# EAGLE design Adafruit DS2482S-800 Breakout (EAGLE 9.6.2)
COMPANY: ADAFRUIT INDUSTRIES; DRAWN: KTOWN; REV: A
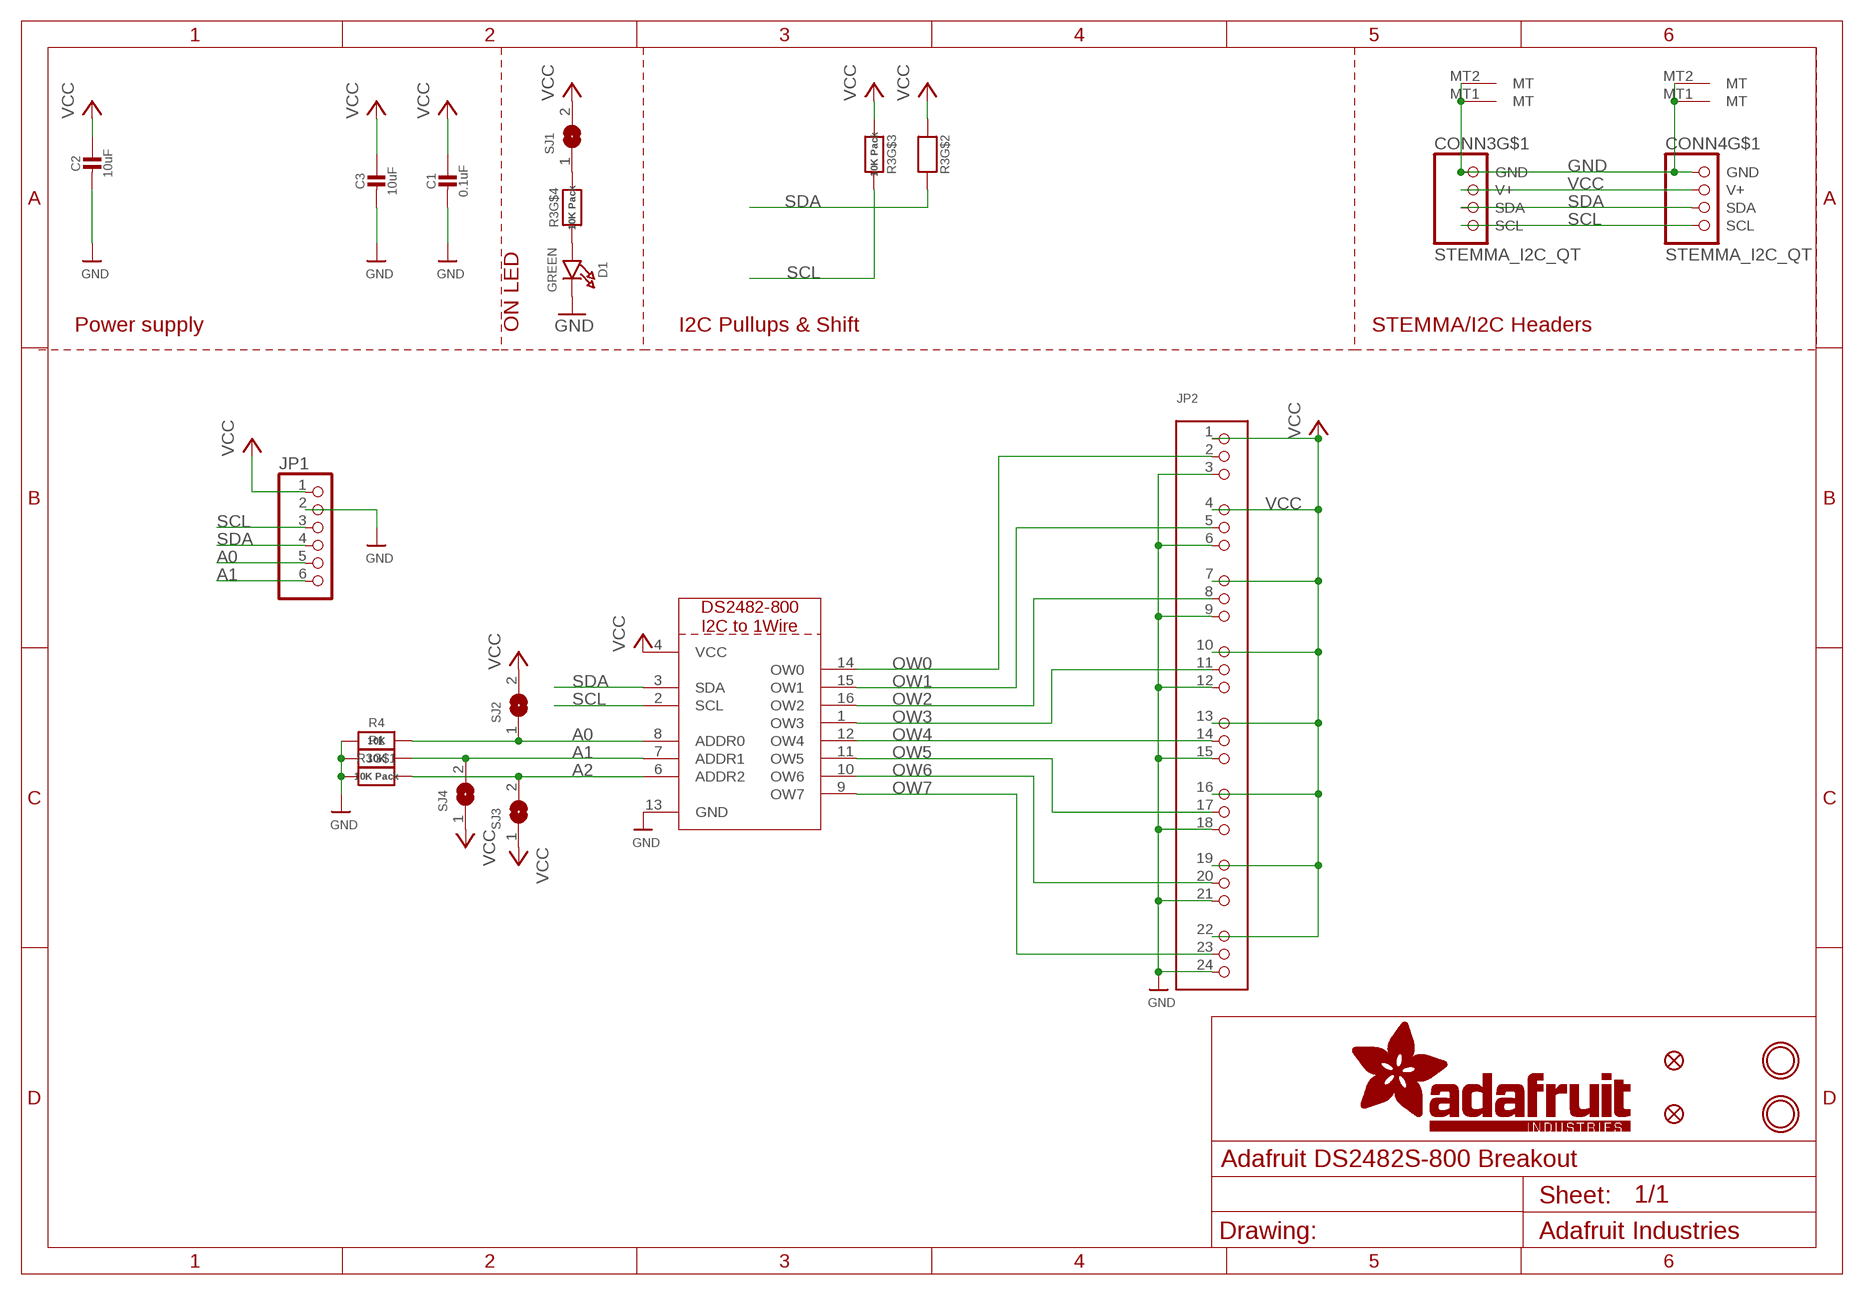
[diagram p0: schematic, sheet 1]

## Parts
C1  0.1uF  CAP_CERAMIC0603_NO  [0603-NO]
C2  10uF  CAP_CERAMIC0805-NOOUTLINE  [0805-NO]
C3  10uF  CAP_CERAMIC0805-NOOUTLINE  [0805-NO]
CONN3  STEMMA_I2C_QT  [JST_SH4]
CONN4  STEMMA_I2C_QT  [JST_SH4]
D1  GREEN  LED0603_NOOUTLINE  [CHIPLED_0603_NOOUTLINE]
FID3  FIDUCIAL_1MM  [FIDUCIAL_1MM]
FID4  FIDUCIAL_1MM  [FIDUCIAL_1MM]
JP1  HEADER-1X670MIL  [1X06_ROUND_70]
JP2  HEADER-3X08  [3X08]
R1  10K  RESISTOR_0603_NOOUT  [0603-NO]
R3  10K Pack  RESISTOR_4PACK  [RESPACK_4X0603]
R4  10K  RESISTOR_0603_NOOUT  [0603-NO]
SJ1  SOLDERJUMPERCLOSED  [SOLDERJUMPER_CLOSEDWIRE]
SJ2  SOLDERJUMPER  [SOLDERJUMPER_ARROW_NOPASTE]
SJ3  SOLDERJUMPER  [SOLDERJUMPER_ARROW_NOPASTE]
SJ4  SOLDERJUMPER  [SOLDERJUMPER_ARROW_NOPASTE]
U$19  MOUNTINGHOLE2.5  [MOUNTINGHOLE_2.5_PLATED]
U$21  MOUNTINGHOLE2.5  [MOUNTINGHOLE_2.5_PLATED]
X1  DS2482-800  [SO16]

## Nets
A0: JP1.5 R4.2 SJ2.1 X1.8(ADDR0)
A1: JP1.6 R1.2 SJ4.2 X1.7(ADDR1)
A2: R3.8 SJ3.2 X1.6(ADDR2)
GND [highpower]: C1.2 C2.2 C3.2 CONN3.1(GND) CONN3.MT1(MT) CONN3.MT2(MT) CONN4.1(GND) CONN4.MT1(MT) CONN4.MT2(MT) D1.C JP1.2 JP2.3 JP2.6 JP2.9 JP2.12 JP2.15 JP2.18 JP2.21 JP2.24 R1.1 R3.1 R4.1 X1.13(GND)
N$1: D1.A R3.4
N$2: R3.5 SJ1.1
OW0: JP2.2 X1.14(OW0)
OW1: JP2.5 X1.15(OW1)
OW2: JP2.8 X1.16(OW2)
OW3: JP2.11 X1.1(OW3)
OW4: JP2.14 X1.12(OW4)
OW5: JP2.17 X1.11(OW5)
OW6: JP2.20 X1.10(OW6)
OW7: JP2.23 X1.9(OW7)
SCL: CONN3.4(SCL) CONN4.4(SCL) JP1.3 R3.6 X1.2(SCL)
SDA: CONN3.3(SDA) CONN4.3(SDA) JP1.4 R3.7 X1.3(SDA)
VCC [highpower]: C1.1 C2.1 C3.1 CONN3.2(V+) CONN4.2(V+) JP1.1 JP2.1 JP2.4 JP2.7 JP2.10 JP2.13 JP2.16 JP2.19 JP2.22 R3.2 R3.3 SJ1.2 SJ2.2 SJ3.1 SJ4.1 X1.4(VCC)

## Notes on the sheet
- Power supply | ON LED | I2C Pullups & Shift | STEMMA/I2C Headers

## Library data of the parts
C1-C3 = microbuilder:CAP_CERAMIC: Ceramic Capacitors For new designs, use the packages preceded by an '_' character since they are more reliable: The following footprints should be used on most boards: _0402 - Standard footprint for regular board layouts _0603 - Standard footprint for regular board layouts _0805 - Standard footprint for regular board layouts _1206 - Standard footprint for regular board layouts For extremely tight-pitch boards where space is at a premium, the following 'micro-pitch' footprints can be used (smaller pads, no silkscreen outline, etc.): _0402MP - Micro-pitch footprint for very dense/compact boards _0603MP - Micro-pitch footprint for very dense/compact boards _0805MP - Micro-pitch footprint for very dense/compact boards _1206MP - Micro-pitch footprint for very dense/compact boards
CONN3 CONN4 = adafruit_electromech:STEMMA_I2C; LCSC: C2845363
D1 = microbuilder:LED: LED 0603 - 0603 Surface Mount Package 2mA: Green LED - Low Power (3.9mcd, 2ma, 1.7Vf) - Digikey: 475-2709-2-ND Orange LED - Low Power (9.8mcd, 2ma, 1.8Vf) - Digikey: 475-1194-2-ND Red LED - Low Power (5mcd, 2ma, 1.8Vf) - Digikey: 475-1195-2-ND Yellow LED - Low Power (7mcd, 2ma, 1.8Vf) - Digikey: 475-1196-2-ND 5mA: Blue LED - Low Power (17mcd, 5ma, 2.9Vf) - Digikey: LNJ937W8CRACT-ND 0805 - 0805 Surface Mount Package 2mA: Red LED (8.8mcd, 2mA, 1.8Vf, Clear) - Low Power [Digikey: 475-2510-1-ND] Green LED (5mcd, 2mA, 1.8Vf, Clear) - Low Power [Digikey: 475-2730-1-ND] Yellow LED (11.3mcd, 2mA, 1.8Vf, Clear) - Low Power [Digikey: 475-2555-1-ND] 20mA: Red LED (104mcd, 20mA, Diffused) - LS R976 [Digikey: 475-1278-6-ND] Red LED (12mcd, 20mA, 2.0Vf, Clear) - APT2012EC [Digikey: 754-1128-1-ND] Green LED (15mcd, 20mA, 2.2Vf, Clear) - APT2012GC [Digikey: 754-1131-1-ND] Orange LED (160mcd, 20mA, 2.1Vf, Clear) - APT2012SECK [Digikey: 754-1130-1-ND] 1206 - 1206 Surface Mount Package Green LED (26mcd, 20mA, Diffused) - LG N971 [Digikey: 475-1407-6-ND] Red LED (15mcd, 20mA, Diffused) - LH N974 [Digikey: 475-1416-6-ND] Cree - Cree High-Power Surface Mount LEDs XPEBWT-L1-0000-00D50 - White 111lm 350mA 2.9Vf 6200K 110° XTEAWT-00-0000-00000LEE3 - White 114lm 350mA 2.85Vf 5000K 115° Everlight - Everlight 45-21 Series Surface Mount LEDs 45-21/QK2C-B2832AC2CB2/2T - Warm White 2000mcd 20mA 3.25Vf 3050K 120° 45-21/LK2C-B38452C4CB2/2T - Nuetral White 2000mcd 20mA 3.25Vf 4150K 120° 45-21/LK2C-B50634C6CB2/2T - Cold White 2200mcd 20mA 3.25Vf 5650K 120° PLCC2 Reverse Mount LS T77K-J1L2-1-0-2-R18-Z - Red 11.25mcd 2mA 1.8Vf 630nm 120° LO T77K-L1M2-24-Z - Orange 19.6mcd 2mA 1.8Vf 606nm 120° LY T77K-K2M1-26-Z - Yellow 15.7mcd 2mA 1.8Vf 587nm 120°; ROT: 270
FID3 FID4 = microbuilder:FIDUCIAL: Fiducial Alignment Points Various fiducial points for machine vision alignment.; BOM: EXCLUDE
JP1 = microbuilder:HEADER-1X6: PIN HEADER
JP2 = microbuilder:HEADER-3X08: 3x8 0.1" Headers Male - 4UCON: 01058
R1 R4 = microbuilder:RESISTOR: Resistors For new designs, use the packages preceded by an '_' character since they are more reliable: The following footprints should be used on most boards: _0402 - Standard footprint for regular board layouts _0603 - Standard footprint for regular board layouts _0805 - Standard footprint for regular board layouts _1206 - Standard footprint for regular board layouts For extremely tight-pitch boards where space is at a premium, the following 'micro-pitch' footprints can be used (smaller pads, no silkscreen outline, etc.): _0402MP - Micro-pitch footprint for very dense/compact boards _0603MP - Micro-pitch footprint for very dense/compact boards _0805MP - Micro-pitch footprint for very dense/compact boards _1206MP - Micro-pitch footprint for very dense/compact boards
R3 = microbuilder:RESISTOR_4PACK: Resistor Packs (4 resistors) 4 x 0603 10K 1/16W - Digikey: YC164J-10KCT-ND
SJ1 = microbuilder:SOLDERJUMPER: SMD Solder JUMPER Solder the two pads together to create a connection, or remove the solder to break it. REFLOW - Use this footprint for solder paste and reflow ovens. WAVE - Use this footprint for hand-soldering (larger pads). CLOSED - Has a trace between the two pads to ensure it is closed by default. The trace needs to be cut to disable the jumper, and can be closed again by creating a solder bridge between the two pads.
SJ2-SJ4 = microbuilder:SOLDERJUMPER: SMD Solder JUMPER Solder the two pads together to create a connection, or remove the solder to break it. REFLOW - Use this footprint for solder paste and reflow ovens. WAVE - Use this footprint for hand-soldering (larger pads). CLOSED - Has a trace between the two pads to ensure it is closed by default. The trace needs to be cut to disable the jumper, and can be closed again by creating a solder bridge between the two pads.; BOM: EXCLUDE
U$19 U$21 = adafruit_electromech:MOUNTINGHOLE: Mounting Hole For #2 screws (0.086"/2.18mm width, 0.094"/2.4mm hole) use 2.5mm; BOM: EXCLUDE
X1 = adafruit_sensor:DS2482-800

## Net classes
1 highpower: width 0.305 mm, drill 0.483 mm
2 lowpower: width 0.254 mm, drill 0.483 mm

## Board
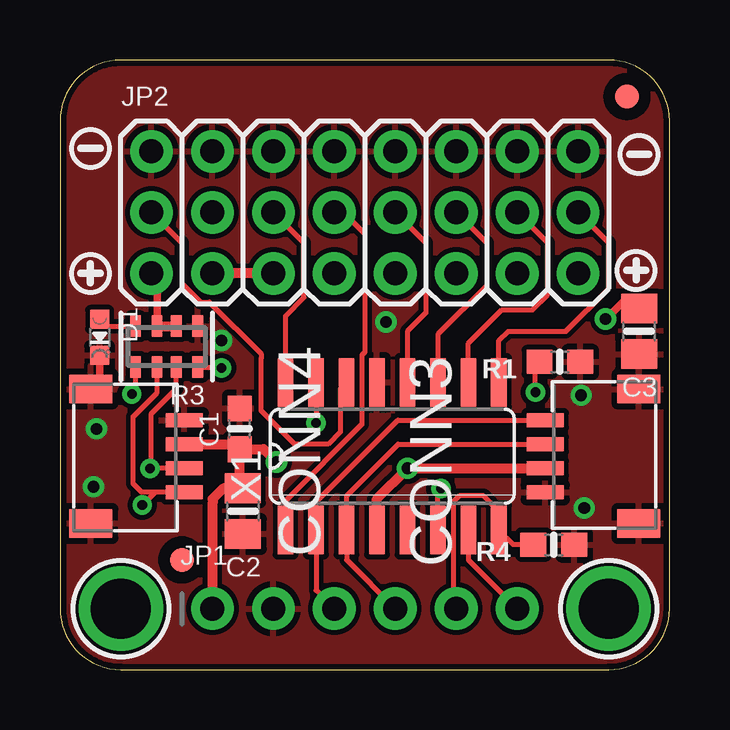
[diagram p1: board, top side]
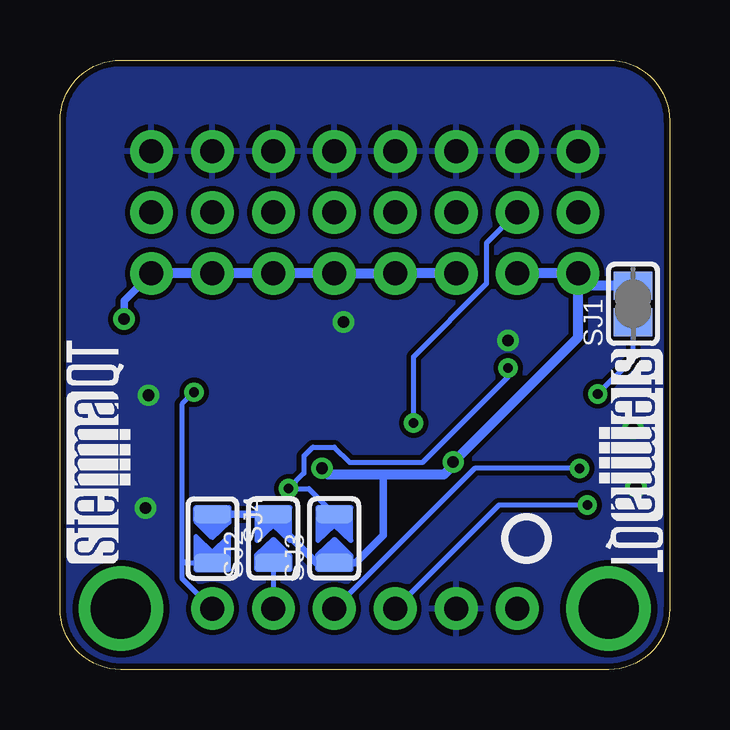
[diagram p2: board, bottom side, seen from below]

Size 25.4 x 25.4 mm. Coordinates in mm from the lower left corner, seen from the top.
Outline: 0,22.86 0,2.54 arc90 2.54,0 22.86,0 arc90 25.4,2.54 25.4,22.86 arc90 22.86,25.4 2.54,25.4 arc90 0,22.86
Copper layers (1*16): Top 0.035mm / dielectric 1.5mm / Bottom 0.035mm
Design rules "adafruit *": minimum track width 8mil, minimum drill 15.5mil, track to track 8mil, track to pad 8mil, pad to pad 8mil, via to via 8mil, smd to smd 8mil, copper to edge 10mil, drill to drill 8mil, minimum pad ring 10mil, minimum via ring 8mil, stop-mask expansion 2mil, vias tented up to drill 20mil, thermal gap 10mil

### Footprints (pad centres in the part's own frame; a part is rotated, then mirrored left to right if it is on the bottom)
0603-NO = smd 1.075 x 1: 1 -0.85,0; 2 0.85,0
0805-NO = smd 1.24 x 1.5: 1 -0.95,0; 2 0.95,0
JST_SH4 = smd 0.6 x 1.55: 1 -1.5,2.006; 2 -0.5,2.006; 3 0.5,2.006; 4 1.5,2.006 | smd 1.2 x 1.8: MT1 -2.8,-1.894; MT2 2.8,-1.894
CHIPLED_0603_NOOUTLINE = smd 0.8 x 0.8: A 0,-0.75; C 0,0.75
FIDUCIAL_1MM = smd 1 x 1: 1 0,0
1X06_ROUND_70 = drill 1 pad 1.778: 1 -6.35,0; 2 -3.81,0; 3 -1.27,0; 4 1.27,0; 5 3.81,0; 6 6.35,0
3X08 = drill 1 pad 1.778: 1 -8.89,-2.54; 2 -8.89,0; 3 -8.89,2.54; 4 -6.35,-2.54; 5 -6.35,0; 6 -6.35,2.54; 7 -3.81,-2.54; 8 -3.81,0; 9 -3.81,2.54; 10 -1.27,-2.54; 11 -1.27,0; 12 -1.27,2.54; 13 1.27,-2.54; 14 1.27,0; 15 1.27,2.54; 16 3.81,-2.54; 17 3.81,0; 18 3.81,2.54; 19 6.35,-2.54; 20 6.35,0; 21 6.35,2.54; 22 8.89,-2.54; 23 8.89,0; 24 8.89,2.54
RESPACK_4X0603 = smd 0.45 x 0.9: 1 -1.3,-0.85; 2 -0.4,-0.85; 3 0.4,-0.85; 4 1.3,-0.85; 5 1.3,0.85; 6 0.4,0.85; 7 -0.4,0.85; 8 -1.3,0.85
SOLDERJUMPER_CLOSEDWIRE = smd 1.168 x 1.6: 1 -0.762,0; 2 0.762,0 | smd 0.635 x 0.203: WIRE 0,0
SOLDERJUMPER_ARROW_NOPASTE = smd 0.762 x 1.524: 1 -1.016,0; 2 1.016,0
MOUNTINGHOLE_2.5_PLATED = drill 2.5 pad 3.2: P$1 0,0
SO16 = smd 0.66 x 2.032: 1 -4.445,-3.073; 2 -3.175,-3.073; 3 -1.905,-3.073; 4 -0.635,-3.073; 5 0.635,-3.073; 6 1.905,-3.073; 7 3.175,-3.073; 8 4.445,-3.073; 9 4.445,3.073; 10 3.175,3.073; 11 1.905,3.073; 12 0.635,3.073; 13 -0.635,3.073; 14 -1.905,3.073; 15 -3.175,3.073; 16 -4.445,3.073

### Placement (x,y rotation side)
C1  7.49,10.03 90 top
C2  7.62,6.6 270 top
C3  24.13,14.1 270 top
CONN3  22.23,8.89 90 top
CONN4  3.17,8.89 270 top
D1  1.65,13.84 180 top
FID3  5.08,4.57 0 top
FID4  23.62,23.88 0 top
JP1  12.7,2.54 0 top
JP2  12.7,19.05 0 top
PLABEL0  [PLABEL0]  6.35,0.89 0 top
PLABEL1  [PLABEL1]  8.89,4.06 0 top
PLABEL2  [PLABEL2]  11.43,0.89 0 top
PLABEL3  [PLABEL3]  13.97,4.06 0 top
PLABEL4  [PLABEL4]  16.51,0.89 0 top
PLABEL5  [PLABEL5]  19.05,4.06 0 top
PLABEL6  [PLABEL6]  13.84,14.22 0 top
PLABEL7  [PLABEL7]  1.02,12.95 90 top
PLABEL8  [PLABEL8]  1.27,18.92 90 top
PLABEL9  [PLABEL9]  24.13,18.92 90 top
PLABEL10  [PLABEL10]  3.81,24.13 0 top
PLABEL11  [PLABEL11]  6.35,24.13 0 top
PLABEL12  [PLABEL12]  8.89,24.13 0 top
PLABEL13  [PLABEL13]  11.43,24.13 0 top
PLABEL14  [PLABEL14]  13.97,24.13 0 top
PLABEL15  [PLABEL15]  16.51,24.13 0 top
PLABEL16  [PLABEL16]  19.05,24.13 0 top
PLABEL17  [PLABEL17]  21.59,24.13 0 top
PLABEL18  [PLABEL18]  12.7,12.19 0 bottom
PLABEL19  [PLABEL19]  12.7,0.89 0 bottom
PLABEL20  [PLABEL20]  1.4,17.65 0 bottom
PLABEL21  [PLABEL21]  19.05,8.13 0 bottom
PLABEL22  [PLABEL22]  16.51,8.13 0 bottom
PLABEL23  [PLABEL23]  13.97,8.13 0 bottom
R1  20.83,12.83 180 top
R3  4.45,13.46 180 top
R4  20.57,5.21 180 top
SJ1  1.52,15.24 90 bottom
SJ2  16.51,5.46 90 bottom
SJ3  13.97,5.46 90 bottom
SJ4  19.05,5.46 270 bottom
U$4  [SYMBOL_MINUS]  1.27,21.72 0 top
U$7  [SYMBOL_MINUS]  24.13,21.46 0 top
U$8  [SYMBOL_PLUS]  1.27,16.51 0 top
U$9  [SYMBOL_PLUS]  24,16.64 0 top
U$19  2.54,2.54 0 top
U$21  22.86,2.54 0 top
U$25  [PCBFEAT-REV-040]  5.97,5.46 0 bottom
U$30  [STEMMAQT]  22.48,4.45 90 bottom
U$31  [STEMMAQT]  2.92,13.34 270 bottom
X1  13.84,8.89 0 top

### Tracks (layer width: path | path; a pad name or v marks a point on that pad's centre or on a via)
A0
  Top 0.203: JP1.5 16.38,2.67 16.38,6.99 16.64,7.24 17.65,7.24 18.29,6.6 X1.8 18.9,5.21 R4.2
  Bottom 0.203: SJ2.1 JP1.5
A1  (via drill 0.4)
  Top 0.203: X1.7 17.02,4.57 JP1.6 | v19.81,11.56 19.81,12.66 R1.2
  Bottom 0.203: JP1.6 20.32,3.81 20.32,4.57 | v19.81,11.56 20.32,11.05 20.32,4.57 | 20.32,4.57 20.19,4.45 SJ4.2
A2  (via drill 0.4)
  Top 0.203: X1.6 15.75,7.41 v15.88,7.54 | v6.73,12.57 5.78,12.57 R3.8
  Bottom 0.203: v6.73,12.57 6.73,12.19 10.29,8.64 13.34,8.64 13.97,9.27 14.86,9.27 15.24,8.89 15.24,8.17 v15.88,7.54 15.03,7.54 SJ3.2
GND  (via drill 0.48)
  Top 0.305: D1.C 1.65,12.06 CONN4.MT1
  other vias: 13.59,14.48 21.72,11.43 21.84,6.73 1.4,7.62 1.52,10.03 6.73,13.72
  pour Top: 0,25.4 25.4,25.4 25.4,0 0,0
  pour Bottom: 0,25.4 25.4,25.4 25.4,0 0,0
N$1
  Top 0.203: D1.A 1.72,14.59 2,14.31 R3.4
N$2  (via drill 0.4)
  Top 0.203: R3.5 3.15,11.64 v2.99,11.49
  Bottom 0.203: v2.99,11.49 1.52,12.95 SJ1.1
OW0
  Top 0.203: X1.14 11.68,11.71 11.68,9.91 11.18,9.4 9.78,9.4 8.38,10.79 8.38,12.95 8.38,13.16 6.22,15.32 5.86,15.32 5.08,16.09 5.08,17.78 JP2.2
OW1  (via drill 0.4)
  Top 0.203: X1.15 v10.67,10.27
  Bottom 0.203: v10.67,10.27 10.67,13.04 7.62,16.09 7.62,17.78 JP2.5
OW2
  Top 0.203: X1.16 9.4,14.73 10.16,15.49 10.16,17.78 JP2.8
OW3
  Top 0.203: JP2.11 11.81,19.05 12.7,18.16 12.7,13.23 12.57,13.11 12.57,10.22 9.4,7.04 X1.1
OW4
  Top 0.203: JP2.14 15.24,17.78 15.24,14.86 14.48,14.1 X1.12
OW5
  Top 0.203: JP2.17 17.78,17.78 17.78,16 15.75,13.97 X1.11
OW6
  Top 0.203: X1.10 17.02,13.59 18.41,14.99 19.68,14.99 20.32,15.62 20.32,17.78 JP2.20
OW7
  Top 0.203: X1.9 18.29,13.72 18.67,14.1 21.08,14.1 22.86,15.88 22.86,17.78 JP2.23
SCL  (via drill 0.4)
  Top 0.203: JP1.3 10.67,3.3 X1.2 10.67,6.99 14.07,10.39 CONN3.4 | CONN4.4 3.96,7.39 | 3.96,7.39 3.4,7.39 3.05,7.75 3.05,10.54 4.04,11.54 R3.6 | 3.96,7.39 v3.43,6.86
  Bottom 0.203: v3.43,6.86 7.11,6.86 JP1.3
SDA  (via drill 0.4)
  Top 0.203: JP1.4 11.94,4.57 X1.3 11.94,7.24 14.09,9.39 CONN3.3 | CONN4.3 3.93,8.39 3.87,8.45 | 3.87,8.45 3.81,8.51 3.81,10.67 4.84,11.7 R3.7 | 3.87,8.45 3.81,8.38 v3.76,8.38
  Bottom 0.203: v3.76,8.38 8.13,8.38 JP1.4
VCC  (via drill 0.48)
  Top 0.305: JP2.1 4.04,16.27 R3.3 | C3.1 23.65,15.52 v22.73,14.61
  Top 0.406: X1.4 13.21,7.11 v14.49,8.39 CONN3.2 | CONN4.2 7.29,9.39 C1.1 | C1.1 7.49,7.68 C2.1 6.8,7.55 6.36,7.11 6.36,6.92 6.35,6.91 JP1.1 | C1.1 8.48,9.18 v9.02,8.65 | R3.3 R3.2 | JP2.7 JP2.4
  Bottom 0.305: v22.73,14.61 22.73,15.37 JP2.22 | SJ4.1 SJ2.2 16.13,6.48 16.13,5.84 14.73,4.45 SJ3.1 13.08,4.45 11.94,5.59 11.94,8.13
  Bottom 0.406: v14.49,8.39 14.22,8.13 11.94,8.13 9.41,8.13 9.02,8.52 v9.02,8.65 3.81,13.86 3.81,16 | 3.81,16 JP2.1 JP2.4 | JP2.22 JP2.19 JP2.16 JP2.13 JP2.10 JP2.7 | SJ1.2 3.81,16

### Text on the board
Pinguin_tBackup: 0 | 1 | 2 | 3 | 4 | 5 | 6 | 7 | 1W | 1W | DS2482-800 | on | GND | SDA | A1 | VIN | SCL | A0
Pinguin_bBackup: LED | DS2482-800 / I2C to 1-Wire / 8 Channels | A2 | A0 | A1 | VLogic/Vcc: 3-5VDC